# EAGLE schematic subpar-drive (EAGLE 9.5.0)
COMPANY: SubparEV; CREVISION: 0.0; DESIGNER: Rafael Silva; LICENSE: GNU General Public License v3.0; LINK: https://github.com/SubparEV/subpar-drive

## Sheet 1 of 3: main app processor, DSP
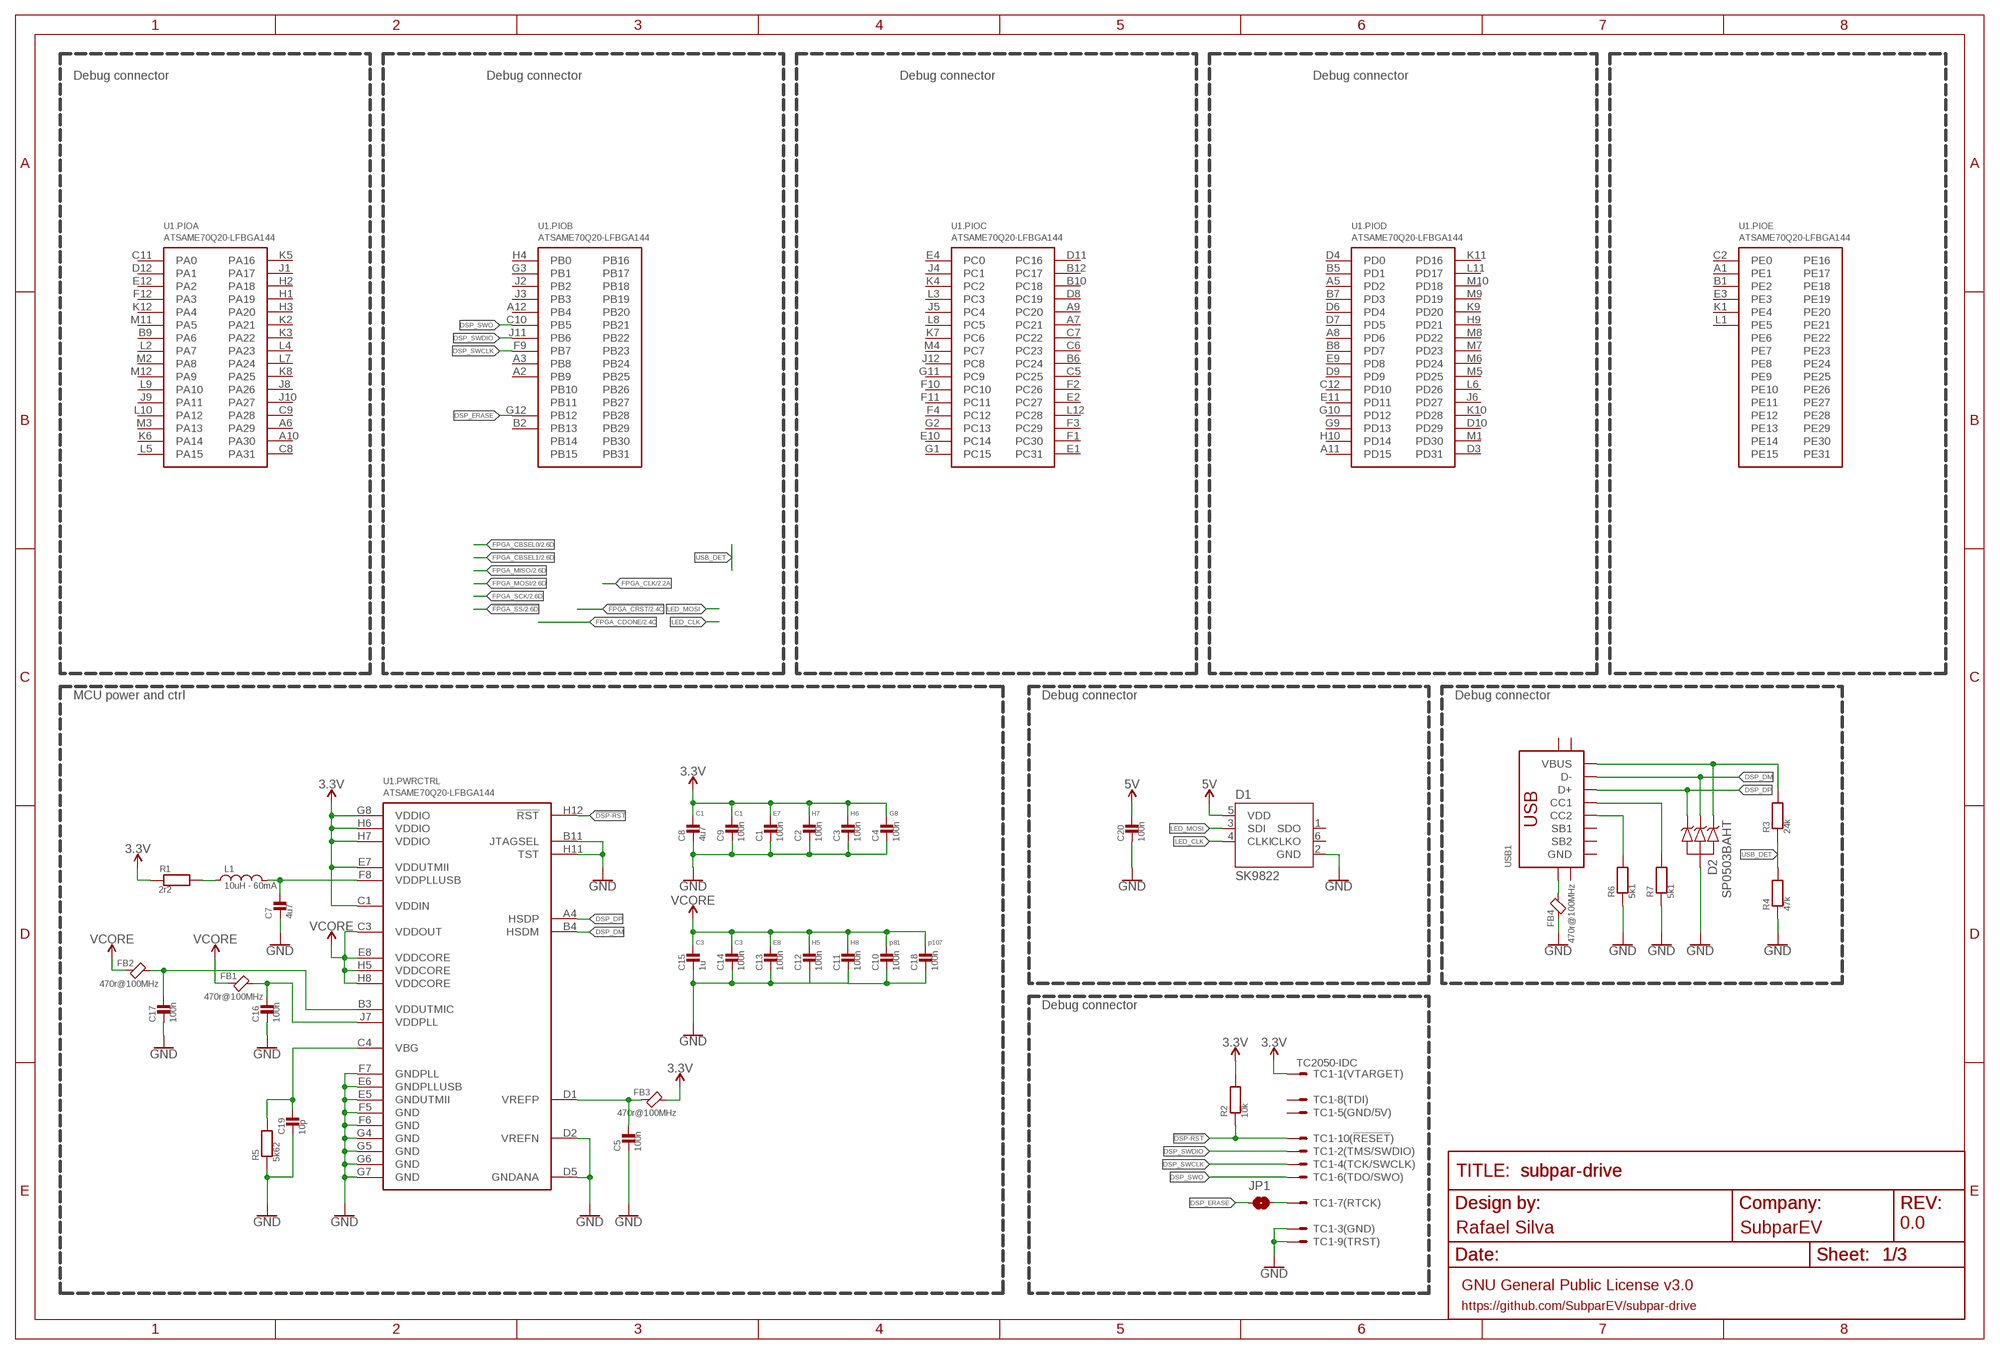
[diagram p0: schematic, sheet 1]

### Parts
C1  100n  MLCC_0402  [_0402]
C2  100n  MLCC_0402  [_0402]
C3  100n  MLCC_0402  [_0402]
C4  100n  MLCC_0402  [_0402]
C5  100n  MLCC_0402  [_0402]
C7  4u7  MLCC0603  [0603_WAVE]
C8  4u7  MLCC0603  [0603_WAVE]
C9  100n  MLCC_0402  [_0402]
C10  100n  MLCC_0402  [_0402]
C11  100n  MLCC_0402  [_0402]
C12  100n  MLCC_0402  [_0402]
C13  100n  MLCC_0402  [_0402]
C14  100n  MLCC_0402  [_0402]
C15  1u  MLCC0603  [0603_WAVE]
C16  100n  MLCC_0402  [_0402]
C17  100n  MLCC_0402  [_0402]
C18  100n  MLCC_0402  [_0402]
C19  10p  MLCC_0402  [_0402]
C20  100n  MLCC0603  [0603_WAVE]
D1  SK9822  [2020]
D2  SP0503BAHT  [SOT143]
FB1  470r@100MHz  FERRITE_0402  [_0402]
FB2  470r@100MHz  FERRITE_0402  [_0402]
FB3  470r@100MHz  FERRITE_0402  [_0402]
FB4  470r@100MHz  FERRITE_0402  [_0402]
JP1  JUMPER-SMT_2_NO_SILK_ROUND  [SMT-JUMPER_2_NO_SILK_ROUND]
L1  10uH - 60mA  INDUCTOR_NC_0402  [_0402]
R1  2r2  RESISTOR_0402  [_0402]
R2  10k  RESISTOR_0402  [_0402]
R3  24k  RESISTOR_0402  [_0402]
R4  47k  RESISTOR_0402  [_0402]
R5  5k62  RESISTOR_0402  [_0402]
R6  5k1  RESISTOR_0402  [_0402]
R7  5k1  RESISTOR_0402  [_0402]
TC1  TC2050-IDC  [TC2050-IDC]
U1  ATSAME70Q20-LFBGA144  [LFBGA144]
USB1  USB-C-16P-SMD-FLAT-SIDE-TYPE-1  [USB-C-16P-SMD-FLAT-SIDE-TYPE-1]

### Nets
3.3V: C1.1 C2.1 C3.1 C4.1 C8.P$1 C9.1 FB3.2 R1.1 R2.2 TC1.1 U1.C1(.PWRCTRL:VDDIN) U1.E7(.PWRCTRL:VDDUTMII) U1.G8(.PWRCTRL:VDDIO) U1.H6(.PWRCTRL:VDDIO) U1.H7(.PWRCTRL:VDDIO) ; also sheet 2
5V: C20.P$1 D1.5(VDD)
!DSP-RST: R2.1 TC1.10 U1.H12(.PWRCTRL:!RST)
DSP_DM: D2.3 U1.B4(.PWRCTRL:HSDM) USB1.A7(D-) USB1.B7(D-)
DSP_DP: D2.2 U1.A4(.PWRCTRL:HSDP) USB1.A6(D+) USB1.B6(D+)
DSP_ERASE: JP1.1 U1.G12(.PIOB:PB12)
DSP_SWCLK: TC1.4 U1.F9(.PIOB:PB7)
DSP_SWDIO: TC1.2 U1.J11(.PIOB:PB6)
DSP_SWO: TC1.6 U1.C10(.PIOB:PB5)
GND: C1.2 C2.2 C3.2 C4.2 C5.2 C7.P$2 C8.P$2 C9.2 C10.2 C11.2 C12.2 C13.2 C14.2 C15.P$2 C16.2 C17.2 C18.2 C19.2 C20.P$2 D1.2(GND) D2.1 FB4.1 R4.1 R5.1 R6.1 R7.1 TC1.3 TC1.9 U1.B11(.PWRCTRL:JTAGSEL) U1.D2(.PWRCTRL:VREFN) U1.D5(.PWRCTRL:GNDANA) U1.E5(.PWRCTRL:GNDUTMII) U1.E6(.PWRCTRL:GNDPLLUSB) U1.F5(.PWRCTRL:GND) U1.F6(.PWRCTRL:GND) U1.F7(.PWRCTRL:GNDPLL) U1.G4(.PWRCTRL:GND) U1.G5(.PWRCTRL:GND) U1.G6(.PWRCTRL:GND) U1.G7(.PWRCTRL:GND) U1.H11(.PWRCTRL:TST) ; also sheet 2
LED_CLK: D1.4(CLKI)
LED_MOSI: D1.3(SDI)
N$1: JP1.2 TC1.7
N$2: C17.1 FB2.2 U1.B3(.PWRCTRL:VDDUTMIC)
N$3: C7.P$1 L1.2 U1.F8(.PWRCTRL:VDDPLLUSB)
N$4: C16.1 FB1.2 U1.J7(.PWRCTRL:VDDPLL)
N$5: L1.1 R1.2
N$6: C19.1 R5.2 U1.C4(.PWRCTRL:VBG)
N$7: C5.1 FB3.1 U1.D1(.PWRCTRL:VREFP)
N$8: D2.4 R3.2 USB1.A4/B9(VBUS) USB1.B4/A9(VBUS)
N$9: R7.2 USB1.A5(CC1)
N$10: R6.2 USB1.B5(CC2)
N$11: FB4.2 USB1.SHIELD@2(SHIELD)
USB_DET: R3.1 R4.2
VCORE: C10.1 C11.1 C12.1 C13.1 C14.1 C15.P$1 C18.1 FB1.1 FB2.1 U1.C3(.PWRCTRL:VDDOUT) U1.E8(.PWRCTRL:VDDCORE) U1.H5(.PWRCTRL:VDDCORE) U1.H8(.PWRCTRL:VDDCORE)
Unconnected: D1.1(SDO) D1.6(CLKO) TC1.5 TC1.8 U1.A1(.PIOE:PE1) U1.A2(.PIOB:PB9) U1.A3(.PIOB:PB8) U1.A5(.PIOD:PD2) U1.A6(.PIOA:PA29) U1.A7(.PIOC:PC21) U1.A8(.PIOD:PD6) U1.A9(.PIOC:PC20) U1.A10(.PIOA:PA30) U1.A11(.PIOD:PD15) U1.A12(.PIOB:PB4) U1.B1(.PIOE:PE2) U1.B2(.PIOB:PB13) U1.B5(.PIOD:PD1) U1.B6(.PIOC:PC24) U1.B7(.PIOD:PD3) U1.B8(.PIOD:PD7) U1.B9(.PIOA:PA6) U1.B10(.PIOC:PC18) U1.B12(.PIOC:PC17) U1.C2(.PIOE:PE0) U1.C5(.PIOC:PC25) U1.C6(.PIOC:PC23) U1.C7(.PIOC:PC22) U1.C8(.PIOA:PA31) U1.C9(.PIOA:PA28) U1.C11(.PIOA:PA0) U1.C12(.PIOD:PD10) U1.D3(.PIOD:PD31) U1.D4(.PIOD:PD0) U1.D6(.PIOD:PD4) U1.D7(.PIOD:PD5) U1.D8(.PIOC:PC19) U1.D9(.PIOD:PD9) U1.D10(.PIOD:PD29) U1.D11(.PIOC:PC16) U1.D12(.PIOA:PA1) U1.E1(.PIOC:PC31) U1.E2(.PIOC:PC27) U1.E3(.PIOE:PE3) U1.E4(.PIOC:PC0) U1.E9(.PIOD:PD8) U1.E10(.PIOC:PC14) U1.E11(.PIOD:PD11) U1.E12(.PIOA:PA2) U1.F1(.PIOC:PC30) U1.F2(.PIOC:PC26) U1.F3(.PIOC:PC29) U1.F4(.PIOC:PC12) U1.F10(.PIOC:PC10) U1.F11(.PIOC:PC11) U1.F12(.PIOA:PA3) U1.G1(.PIOC:PC15) U1.G2(.PIOC:PC13) U1.G3(.PIOB:PB1) U1.G9(.PIOD:PD13) U1.G10(.PIOD:PD12) U1.G11(.PIOC:PC9) U1.H1(.PIOA:PA19) U1.H2(.PIOA:PA18) U1.H3(.PIOA:PA20) U1.H4(.PIOB:PB0) U1.H9(.PIOD:PD21) U1.H10(.PIOD:PD14) U1.J1(.PIOA:PA17) U1.J2(.PIOB:PB2) U1.J3(.PIOB:PB3) U1.J4(.PIOC:PC1) U1.J5(.PIOC:PC4) U1.J6(.PIOD:PD27) U1.J8(.PIOA:PA26) U1.J9(.PIOA:PA11) U1.J10(.PIOA:PA27) U1.J12(.PIOC:PC8) U1.K1(.PIOE:PE4) U1.K2(.PIOA:PA21) U1.K3(.PIOA:PA22) U1.K4(.PIOC:PC2) U1.K5(.PIOA:PA16) U1.K6(.PIOA:PA14) U1.K7(.PIOC:PC6) U1.K8(.PIOA:PA25) U1.K9(.PIOD:PD20) U1.K10(.PIOD:PD28) U1.K11(.PIOD:PD16) U1.K12(.PIOA:PA4) U1.L1(.PIOE:PE5) U1.L2(.PIOA:PA7) U1.L3(.PIOC:PC3) U1.L4(.PIOA:PA23) U1.L5(.PIOA:PA15) U1.L6(.PIOD:PD26) U1.L7(.PIOA:PA24) U1.L8(.PIOC:PC5) U1.L9(.PIOA:PA10) U1.L10(.PIOA:PA12) U1.L11(.PIOD:PD17) U1.L12(.PIOC:PC28) U1.M1(.PIOD:PD30) U1.M2(.PIOA:PA8) U1.M3(.PIOA:PA13) U1.M4(.PIOC:PC7) U1.M5(.PIOD:PD25) U1.M6(.PIOD:PD24) U1.M7(.PIOD:PD23) U1.M8(.PIOD:PD22) U1.M9(.PIOD:PD19) U1.M10(.PIOD:PD18) U1.M11(.PIOA:PA5) U1.M12(.PIOA:PA9) USB1.A1/B12(GND) USB1.A8(SB1) USB1.B1/A12(GND) USB1.B8(SB2) USB1.SHIELD@0(SHIELD) USB1.SHIELD@1(SHIELD) USB1.SHIELD@3(SHIELD)

### Notes on the sheet
- Debug connector | Debug connector | Debug connector | Debug connector
- MCU power and ctrl | Debug connector | Debug connector
- C1 | C1 | E7 | H7 | H6 | G8
- C3 | C3 | E8 | H5 | H8 | p81 | p107
- Debug connector

## Sheet 2 of 3: Fault manger & sigma delta demodulator
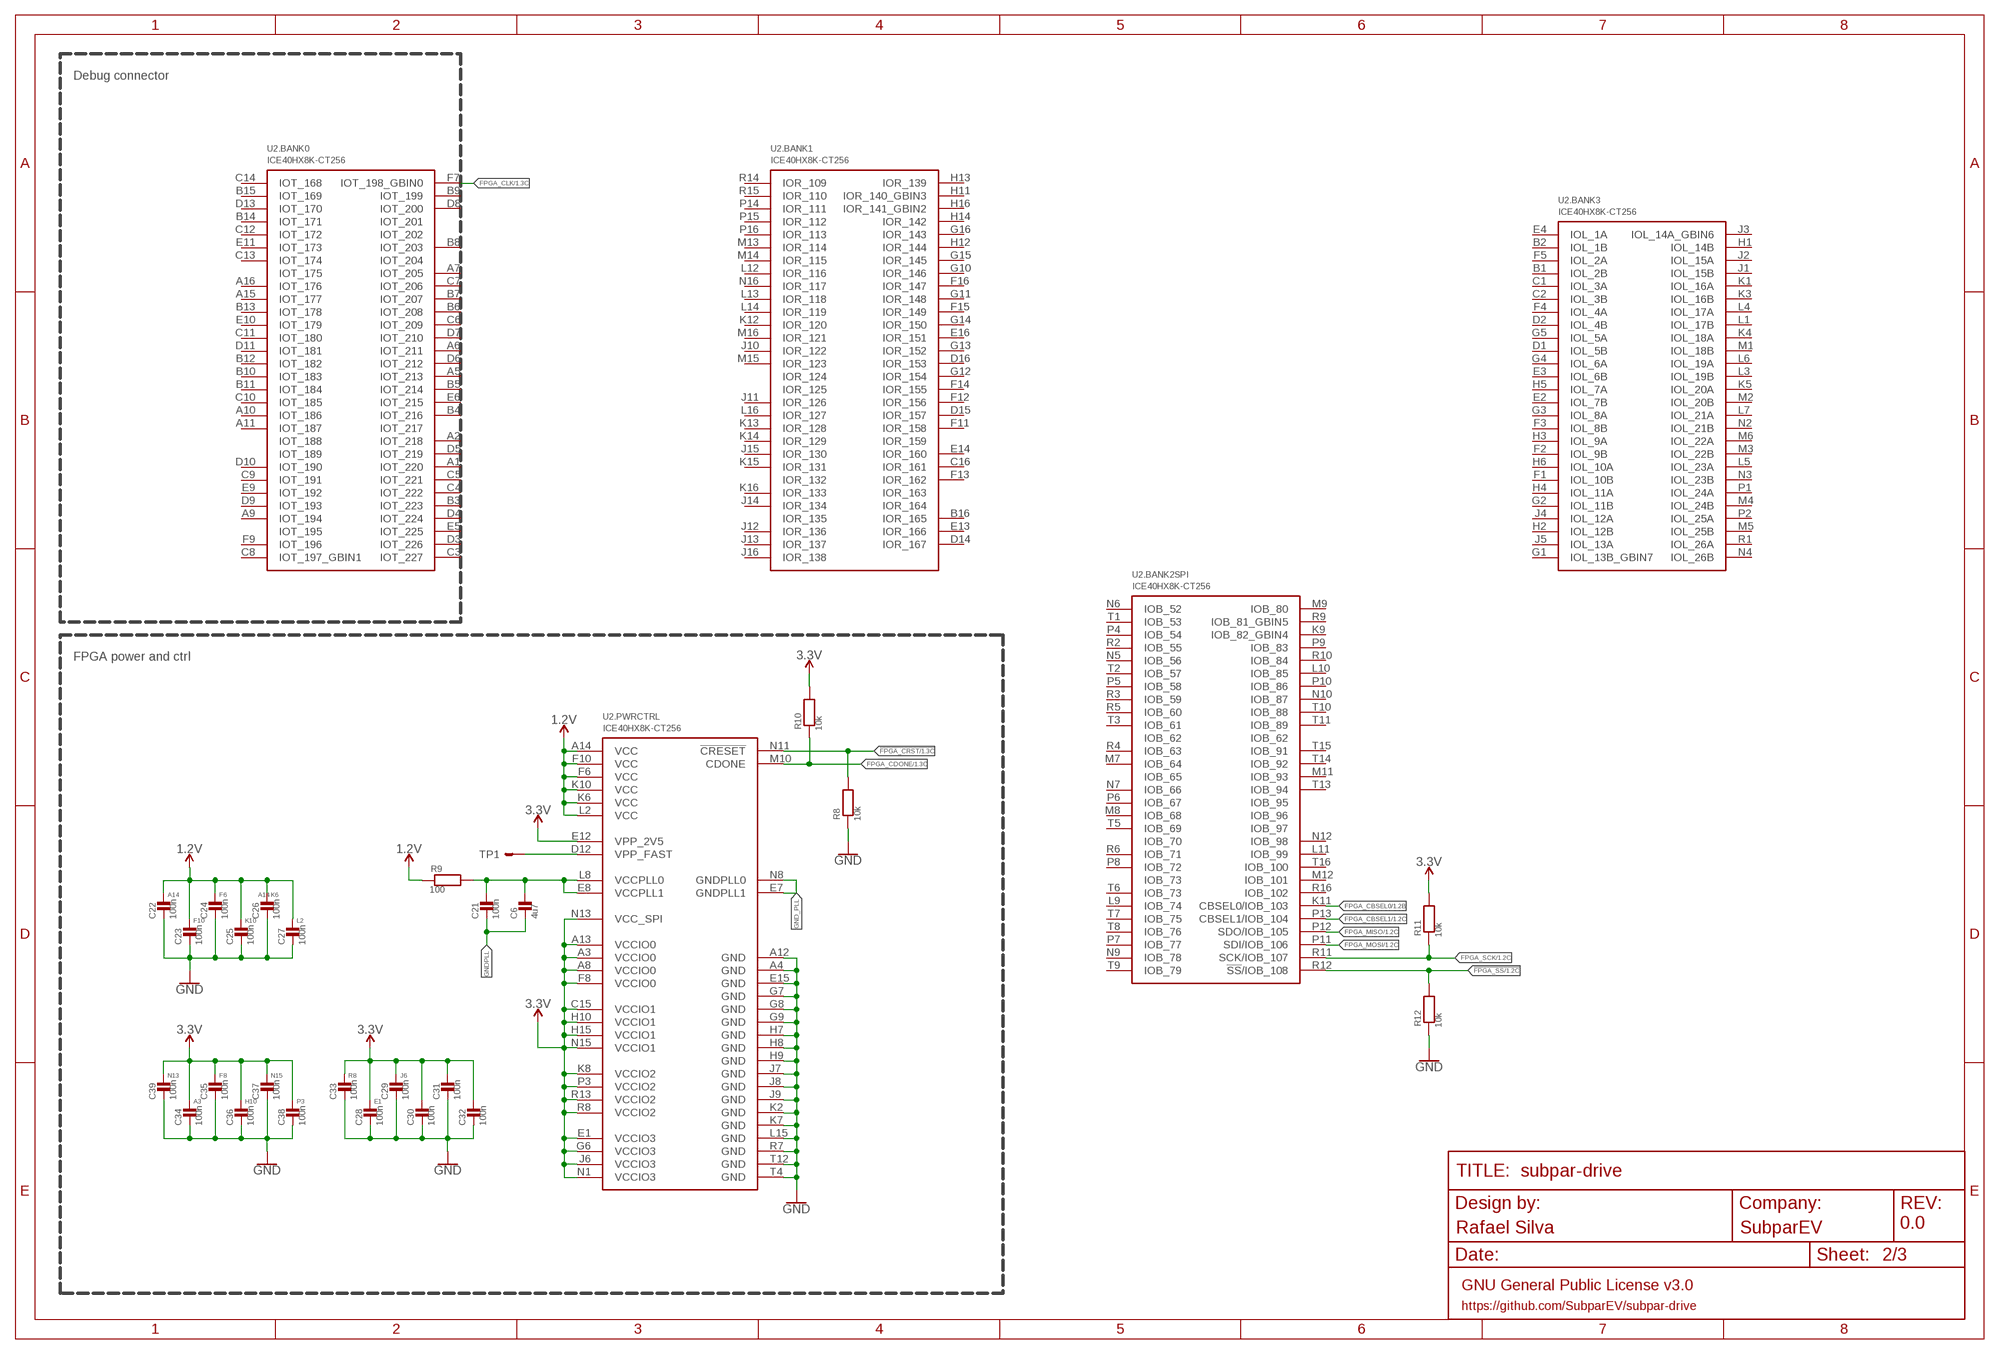
[diagram p1: schematic, sheet 2]

### Parts
C6  4u7  MLCC0603  [0603_WAVE]
C21  100n  MLCC_0402  [_0402]
C22  100n  MLCC_0402  [_0402]
C23  100n  MLCC_0402  [_0402]
C24  100n  MLCC_0402  [_0402]
C25  100n  MLCC_0402  [_0402]
C26  100n  MLCC_0402  [_0402]
C27  100n  MLCC_0402  [_0402]
C28  100n  MLCC_0402  [_0402]
C29  100n  MLCC_0402  [_0402]
C30  100n  MLCC_0402  [_0402]
C31  100n  MLCC_0402  [_0402]
C32  100n  MLCC_0402  [_0402]
C33  100n  MLCC_0402  [_0402]
C34  100n  MLCC_0402  [_0402]
C35  100n  MLCC_0402  [_0402]
C36  100n  MLCC_0402  [_0402]
C37  100n  MLCC_0402  [_0402]
C38  100n  MLCC_0402  [_0402]
C39  100n  MLCC_0402  [_0402]
R8  10k  RESISTOR_0402  [_0402]
R9  100  RESISTOR_0402  [_0402]
R10  10k  RESISTOR_0402  [_0402]
R11  10k  RESISTOR_0402  [_0402]
R12  10k  RESISTOR_0402  [_0402]
TP1  TEST_POINT  [TEST_POINT]
U2  ICE40HX8K-CT256  [CABGA256]

### Nets
1.2V: C22.1 C23.1 C24.1 C25.1 C26.1 C27.1 R9.1 U2.A14(.PWRCTRL:VCC) U2.F6(.PWRCTRL:VCC) U2.F10(.PWRCTRL:VCC) U2.K6(.PWRCTRL:VCC) U2.K10(.PWRCTRL:VCC) U2.L2(.PWRCTRL:VCC)
3.3V: C28.1 C29.1 C30.1 C31.1 C32.1 C33.1 C34.1 C35.1 C36.1 C37.1 C38.1 C39.1 R10.2 R11.2 U2.A3(.PWRCTRL:VCCIO0) U2.A8(.PWRCTRL:VCCIO0) U2.A13(.PWRCTRL:VCCIO0) U2.C15(.PWRCTRL:VCCIO1) U2.E1(.PWRCTRL:VCCIO3) U2.E12(.PWRCTRL:VPP_2V5) U2.F8(.PWRCTRL:VCCIO0) U2.G6(.PWRCTRL:VCCIO3) U2.H10(.PWRCTRL:VCCIO1) U2.H15(.PWRCTRL:VCCIO1) U2.J6(.PWRCTRL:VCCIO3) U2.K8(.PWRCTRL:VCCIO2) U2.N1(.PWRCTRL:VCCIO3) U2.N13(.PWRCTRL:VCC_SPI) U2.N15(.PWRCTRL:VCCIO1) U2.P3(.PWRCTRL:VCCIO2) U2.R8(.PWRCTRL:VCCIO2) U2.R13(.PWRCTRL:VCCIO2) ; also sheet 1
!FPGA_CRST: R8.2 U2.N11(.PWRCTRL:!CRESET) ; also sheet 1
!FPGA_SS: R12.2 U2.R12(.BANK2SPI:!SS!/IOB_108) ; also sheet 1
FPGA_CBSEL0: U2.K11(.BANK2SPI:CBSEL0/IOB_103) ; also sheet 1
FPGA_CBSEL1: U2.P13(.BANK2SPI:CBSEL1/IOB_104) ; also sheet 1
FPGA_CDONE: R10.1 U2.M10(.PWRCTRL:CDONE) ; also sheet 1
FPGA_CLK: U2.F7(.BANK0:IOT_198_GBIN0) ; also sheet 1
FPGA_MISO: U2.P12(.BANK2SPI:SDO/IOB_105) ; also sheet 1
FPGA_MOSI: U2.P11(.BANK2SPI:SDI/IOB_106) ; also sheet 1
FPGA_SCK: R11.1 U2.R11(.BANK2SPI:SCK/IOB_107) ; also sheet 1
GND: C22.2 C23.2 C24.2 C25.2 C26.2 C27.2 C28.2 C29.2 C30.2 C31.2 C32.2 C33.2 C34.2 C35.2 C36.2 C37.2 C38.2 C39.2 R8.1 R12.1 U2.A4(.PWRCTRL:GND) U2.A12(.PWRCTRL:GND) U2.E15(.PWRCTRL:GND) U2.G7(.PWRCTRL:GND) U2.G8(.PWRCTRL:GND) U2.G9(.PWRCTRL:GND) U2.H7(.PWRCTRL:GND) U2.H8(.PWRCTRL:GND) U2.H9(.PWRCTRL:GND) U2.J7(.PWRCTRL:GND) U2.J8(.PWRCTRL:GND) U2.J9(.PWRCTRL:GND) U2.K2(.PWRCTRL:GND) U2.K7(.PWRCTRL:GND) U2.L15(.PWRCTRL:GND) U2.R7(.PWRCTRL:GND) U2.T4(.PWRCTRL:GND) U2.T12(.PWRCTRL:GND) ; also sheet 1
GND_PLL: U2.E7(.PWRCTRL:GNDPLL1) U2.N8(.PWRCTRL:GNDPLL0)
GNDPLL: C6.P$2 C21.2
N$12: C6.P$1 C21.1 R9.2 U2.E8(.PWRCTRL:VCCPLL1) U2.L8(.PWRCTRL:VCCPLL0)
N$13: TP1.1(S) U2.D12(.PWRCTRL:VPP_FAST)
Unconnected: U2.A1(.BANK0:IOT_220) U2.A2(.BANK0:IOT_218) U2.A5(.BANK0:IOT_213) U2.A6(.BANK0:IOT_211) U2.A7(.BANK0:IOT_205) U2.A9(.BANK0:IOT_194) U2.A10(.BANK0:IOT_186) U2.A11(.BANK0:IOT_187) U2.A15(.BANK0:IOT_177) U2.A16(.BANK0:IOT_176) U2.B1(.BANK3:IOL_2B) U2.B2(.BANK3:IOL_1B) U2.B3(.BANK0:IOT_223) U2.B4(.BANK0:IOT_216) U2.B5(.BANK0:IOT_214) U2.B6(.BANK0:IOT_208) U2.B7(.BANK0:IOT_207) U2.B8(.BANK0:IOT_203) U2.B9(.BANK0:IOT_199) U2.B10(.BANK0:IOT_183) U2.B11(.BANK0:IOT_184) U2.B12(.BANK0:IOT_182) U2.B13(.BANK0:IOT_178) U2.B14(.BANK0:IOT_171) U2.B15(.BANK0:IOT_169) U2.B16(.BANK1:IOR_165) U2.C1(.BANK3:IOL_3A) U2.C2(.BANK3:IOL_3B) U2.C3(.BANK0:IOT_227) U2.C4(.BANK0:IOT_222) U2.C5(.BANK0:IOT_221) U2.C6(.BANK0:IOT_209) U2.C7(.BANK0:IOT_206) U2.C8(.BANK0:IOT_197_GBIN1) U2.C9(.BANK0:IOT_191) U2.C10(.BANK0:IOT_185) U2.C11(.BANK0:IOT_180) U2.C12(.BANK0:IOT_172) U2.C13(.BANK0:IOT_174) U2.C14(.BANK0:IOT_168) U2.C16(.BANK1:IOR_161) U2.D1(.BANK3:IOL_5B) U2.D2(.BANK3:IOL_4B) U2.D3(.BANK0:IOT_226) U2.D4(.BANK0:IOT_224) U2.D5(.BANK0:IOT_219) U2.D6(.BANK0:IOT_212) U2.D7(.BANK0:IOT_210) U2.D8(.BANK0:IOT_200) U2.D9(.BANK0:IOT_193) U2.D10(.BANK0:IOT_190) U2.D11(.BANK0:IOT_181) U2.D13(.BANK0:IOT_170) U2.D14(.BANK1:IOR_167) U2.D15(.BANK1:IOR_157) U2.D16(.BANK1:IOR_153) U2.E2(.BANK3:IOL_7B) U2.E3(.BANK3:IOL_6B) U2.E4(.BANK3:IOL_1A) U2.E5(.BANK0:IOT_225) U2.E6(.BANK0:IOT_215) U2.E9(.BANK0:IOT_192) U2.E10(.BANK0:IOT_179) U2.E11(.BANK0:IOT_173) U2.E13(.BANK1:IOR_166) U2.E14(.BANK1:IOR_160) U2.E16(.BANK1:IOR_151) U2.F1(.BANK3:IOL_10B) U2.F2(.BANK3:IOL_9B) U2.F3(.BANK3:IOL_8B) U2.F4(.BANK3:IOL_4A) U2.F5(.BANK3:IOL_2A) U2.F9(.BANK0:IOT_196) U2.F11(.BANK1:IOR_158) U2.F12(.BANK1:IOR_156) U2.F13(.BANK1:IOR_162) U2.F14(.BANK1:IOR_155) U2.F15(.BANK1:IOR_149) U2.F16(.BANK1:IOR_147) U2.G1(.BANK3:IOL_13B_GBIN7) U2.G2(.BANK3:IOL_11B) U2.G3(.BANK3:IOL_8A) U2.G4(.BANK3:IOL_6A) U2.G5(.BANK3:IOL_5A) U2.G10(.BANK1:IOR_146) U2.G11(.BANK1:IOR_148) U2.G12(.BANK1:IOR_154) U2.G13(.BANK1:IOR_152) U2.G14(.BANK1:IOR_150) U2.G15(.BANK1:IOR_145) U2.G16(.BANK1:IOR_143) U2.H1(.BANK3:IOL_14B) U2.H2(.BANK3:IOL_12B) U2.H3(.BANK3:IOL_9A) U2.H4(.BANK3:IOL_11A) U2.H5(.BANK3:IOL_7A) U2.H6(.BANK3:IOL_10A) U2.H11(.BANK1:IOR_140_GBIN3) U2.H12(.BANK1:IOR_144) U2.H13(.BANK1:IOR_139) U2.H14(.BANK1:IOR_142) U2.H16(.BANK1:IOR_141_GBIN2) U2.J1(.BANK3:IOL_15B) U2.J2(.BANK3:IOL_15A) U2.J3(.BANK3:IOL_14A_GBIN6) U2.J4(.BANK3:IOL_12A) U2.J5(.BANK3:IOL_13A) U2.J10(.BANK1:IOR_122) U2.J11(.BANK1:IOR_126) U2.J12(.BANK1:IOR_136) U2.J13(.BANK1:IOR_137) U2.J14(.BANK1:IOR_134) U2.J15(.BANK1:IOR_130) U2.J16(.BANK1:IOR_138) U2.K1(.BANK3:IOL_16A) U2.K3(.BANK3:IOL_16B) U2.K4(.BANK3:IOL_18A) U2.K5(.BANK3:IOL_20A) U2.K9(.BANK2SPI:IOB_82_GBIN4) U2.K12(.BANK1:IOR_120) U2.K13(.BANK1:IOR_128) U2.K14(.BANK1:IOR_129) U2.K15(.BANK1:IOR_131) U2.K16(.BANK1:IOR_133) U2.L1(.BANK3:IOL_17B) U2.L3(.BANK3:IOL_19B) U2.L4(.BANK3:IOL_17A) U2.L5(.BANK3:IOL_23A) U2.L6(.BANK3:IOL_19A) U2.L7(.BANK3:IOL_21A) U2.L9(.BANK2SPI:IOB_74) U2.L10(.BANK2SPI:IOB_85) U2.L11(.BANK2SPI:IOB_99) U2.L12(.BANK1:IOR_116) U2.L13(.BANK1:IOR_118) U2.L14(.BANK1:IOR_119) U2.L16(.BANK1:IOR_127) U2.M1(.BANK3:IOL_18B) U2.M2(.BANK3:IOL_20B) U2.M3(.BANK3:IOL_22B) U2.M4(.BANK3:IOL_24B) U2.M5(.BANK3:IOL_25B) U2.M6(.BANK3:IOL_22A) U2.M7(.BANK2SPI:IOB_64) U2.M8(.BANK2SPI:IOB_68) U2.M9(.BANK2SPI:IOB_80) U2.M11(.BANK2SPI:IOB_93) U2.M12(.BANK2SPI:IOB_101) U2.M13(.BANK1:IOR_114) U2.M14(.BANK1:IOR_115) U2.M15(.BANK1:IOR_123) U2.M16(.BANK1:IOR_121) U2.N2(.BANK3:IOL_21B) U2.N3(.BANK3:IOL_23B) U2.N4(.BANK3:IOL_26B) U2.N5(.BANK2SPI:IOB_56) U2.N6(.BANK2SPI:IOB_52) U2.N7(.BANK2SPI:IOB_66) U2.N9(.BANK2SPI:IOB_78) U2.N10(.BANK2SPI:IOB_87) U2.N12(.BANK2SPI:IOB_98) U2.N16(.BANK1:IOR_117) U2.P1(.BANK3:IOL_24A) U2.P2(.BANK3:IOL_25A) U2.P4(.BANK2SPI:IOB_54) U2.P5(.BANK2SPI:IOB_58) U2.P6(.BANK2SPI:IOB_67) U2.P7(.BANK2SPI:IOB_77) U2.P8(.BANK2SPI:IOB_72) U2.P9(.BANK2SPI:IOB_83) U2.P10(.BANK2SPI:IOB_86) U2.P14(.BANK1:IOR_111) U2.P15(.BANK1:IOR_112) U2.P16(.BANK1:IOR_113) U2.R1(.BANK3:IOL_26A) U2.R2(.BANK2SPI:IOB_55) U2.R3(.BANK2SPI:IOB_59) U2.R4(.BANK2SPI:IOB_63) U2.R5(.BANK2SPI:IOB_60) U2.R6(.BANK2SPI:IOB_71) U2.R9(.BANK2SPI:IOB_81_GBIN5) U2.R10(.BANK2SPI:IOB_84) U2.R14(.BANK1:IOR_109) U2.R15(.BANK1:IOR_110) U2.R16(.BANK2SPI:IOB_102) U2.T1(.BANK2SPI:IOB_53) U2.T2(.BANK2SPI:IOB_57) U2.T3(.BANK2SPI:IOB_61) U2.T5(.BANK2SPI:IOB_69) U2.T6(.BANK2SPI:IOB_73) U2.T7(.BANK2SPI:IOB_75) U2.T8(.BANK2SPI:IOB_76) U2.T9(.BANK2SPI:IOB_79) U2.T10(.BANK2SPI:IOB_88) U2.T11(.BANK2SPI:IOB_89) U2.T13(.BANK2SPI:IOB_94) U2.T14(.BANK2SPI:IOB_92) U2.T15(.BANK2SPI:IOB_91) U2.T16(.BANK2SPI:IOB_100)

### Notes on the sheet
- Debug connector
- FPGA power and ctrl
- A14 | F6 | A14 | K6
- F10 | K10 | L2
- N13 | F8 | N15 | R8 | J6
- A3 | H10 | P3 | E1

## Sheet 3 of 3: Power manager
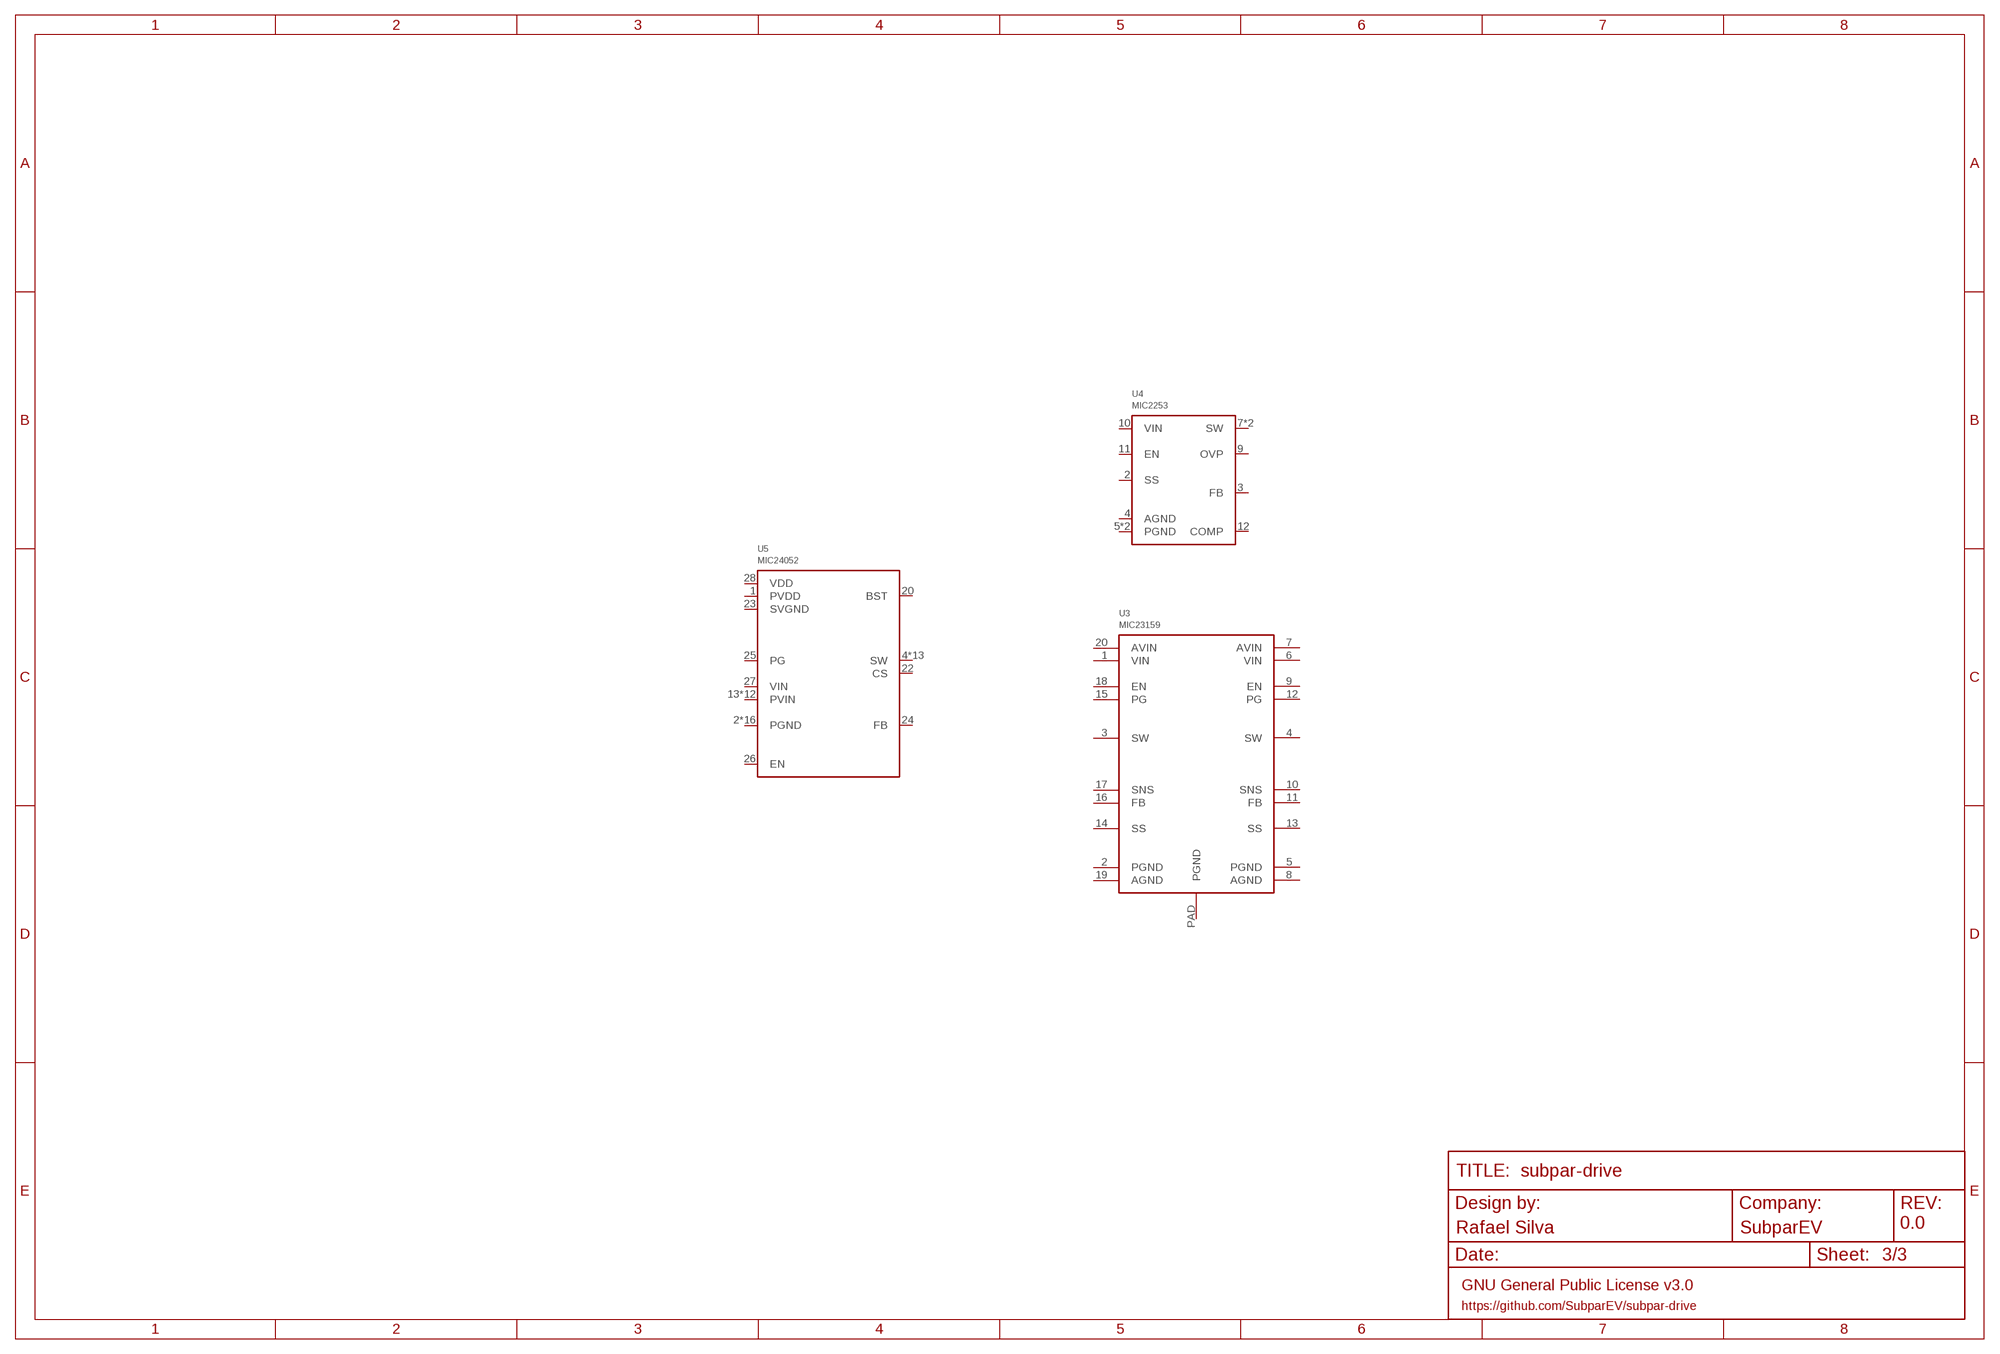
[diagram p2: schematic, sheet 3]

### Parts
U3  MIC23159  [VQFN20]
U4  MIC2253  [DFN12]
U5  MIC24052  [VQFN28]
Unconnected: U3.1(VIN) U3.2(PGND) U3.3(SW) U3.4(SW) U3.5(PGND) U3.6(VIN) U3.7(AVIN) U3.8(AGND) U3.9(EN) U3.10(SNS) U3.11(FB) U3.12(PG) U3.13(SS) U3.14(SS) U3.15(PG) U3.16(FB) U3.17(SNS) U3.18(EN) U3.19(AGND) U3.20(AVIN) U3.PAD(PGND) U4.2(SS) U4.3(FB) U4.4(AGND) U4.5(PGND) U4.6(PGND) U4.7(SW) U4.8(SW) U4.9(OVP) U4.10(VIN) U4.11(EN) U4.12(COMP) U5.1(PVDD) U5.2(PGND) U5.4(SW) U5.5(PGND) U5.6(PGND) U5.7(PGND) U5.8(PGND) U5.9(SW) U5.10(SW) U5.11(SW) U5.12(SW) U5.13(PVIN) U5.14(PVIN) U5.15(PVIN) U5.16(PVIN) U5.17(PVIN) U5.18(PVIN) U5.19(PVIN) U5.20(BST) U5.21(PGND) U5.22(CS) U5.23(SVGND) U5.24(FB) U5.25(PG) U5.26(EN) U5.27(VIN) U5.28(VDD) U5.GNDPAD1(PGND) U5.GNDPAD(PGND) U5.GNDPAD_VIA@0(PGND) U5.GNDPAD_VIA@1(PGND) U5.GNDPAD_VIA@2(PGND) U5.GNDPAD_VIA@3(PGND) U5.GNDPAD_VIA@4(PGND) U5.GNDPAD_VIA@5(PGND) U5.GNDPAD_VIA@6(PGND) U5.GNDPAD_VIA@7(PGND) U5.PVINPAD1(PVIN) U5.PVINPAD(PVIN) U5.PVINPAD_VIA@0(PVIN) U5.PVINPAD_VIA@1(PVIN) U5.PVINPAD_VIA@2(PVIN) U5.SWPAD1(SW) U5.SWPAD(SW) U5.SWPAD_VIA@0(SW) U5.SWPAD_VIA@1(SW) U5.SWPAD_VIA@2(SW) U5.SWPAD_VIA@3(SW) U5.SWPAD_VIA@4(SW) U5.SWPAD_VIA@5(SW)

## Library data of the parts
C1-C39 = Passive Components > Capacitors > Multilayer Ceramic Capacitors MLCC:MLCC: KEMET’s X7R dielectric features a 125°C maximum operating temperature and is considered temperature stable. The Electronics Components, Assemblies and Materials Association (EIA) characterizes X7R dielectric as a Class II material. Components of this classification are fixed, ceramic dielectric capacitors suited for bypass and decoupling applications or for frequency discriminating circuits where Q and stability of capacitance characteristics are not critical. X7R exhibits a predictable change in capacitance with respect to time and voltage, boasting a minimal change in capacitance with reference to ambient temperature. Capacitance change is limited to ±15% from −55°C to +125°C.
D1 = Opto-electronics > LED Emitters:SK9822
D2 = Circuit Protection > ESD Suppressors \ TVS Diodes:SP0503BAHT
FB1-FB4 = Passive Components > Inductors, Chokes & Coils:FERRITE
JP1 = Utility > Board:JUMPER-SMT_2_NO: Normally open jumper This jumper has two pads in close proximity to each other. Apply solder to close the connection. Round pads are easier to solder for beginners, but are a lot larger. SparkFun Product that uses the round pads: SparkFun EL Sequencer <https://www.sparkfun.com/products/12781>
L1 = Passive Components > Inductors, Chokes & Coils:INDUCTOR_NC
R1-R12 = Passive Components > Resistors > Chip Resistors:RESISTOR: Resistors For new designs, use the packages preceded by an '_' character since they are more reliable: The following footprints should be used on most boards: _0402 - Standard footprint for regular board layouts _0603 - Standard footprint for regular board layouts _0805 - Standard footprint for regular board layouts _1206 - Standard footprint for regular board layouts For extremely tight-pitch boards where space is at a premium, the following 'micro-pitch' footprints can be used (smaller pads, no silkscreen outline, etc.): _0402MP - Micro-pitch footprint for very dense/compact boards _0603MP - Micro-pitch footprint for very dense/compact boards _0805MP - Micro-pitch footprint for very dense/compact boards _1206MP - Micro-pitch footprint for very dense/compact boards
TC1 = Connectors > TagConnect:TC2050-IDC
TP1 = Utility > Board:TEST_POINT
U1 = Semiconductors > Embedded Processors & Controllers > Microcontrollers - MCU:ATSAM*-LFBGA144
U2 = Semiconductors > Embedded Processors & Controllers > FPGA - Field Programmable Gate Array:ICE40HX8K-CT256
U3 = Power > Switching Controllers:MIC23159
U4 = Power > Switching Controllers:MIC2253
U5 = Power > Switching Controllers:MIC24052
USB1 = Connectors > USB:USB-C-16P-SMD-FLAT-SIDE